# EAGLE design Prosthesis Motor Shield (EAGLE 6.5.0)
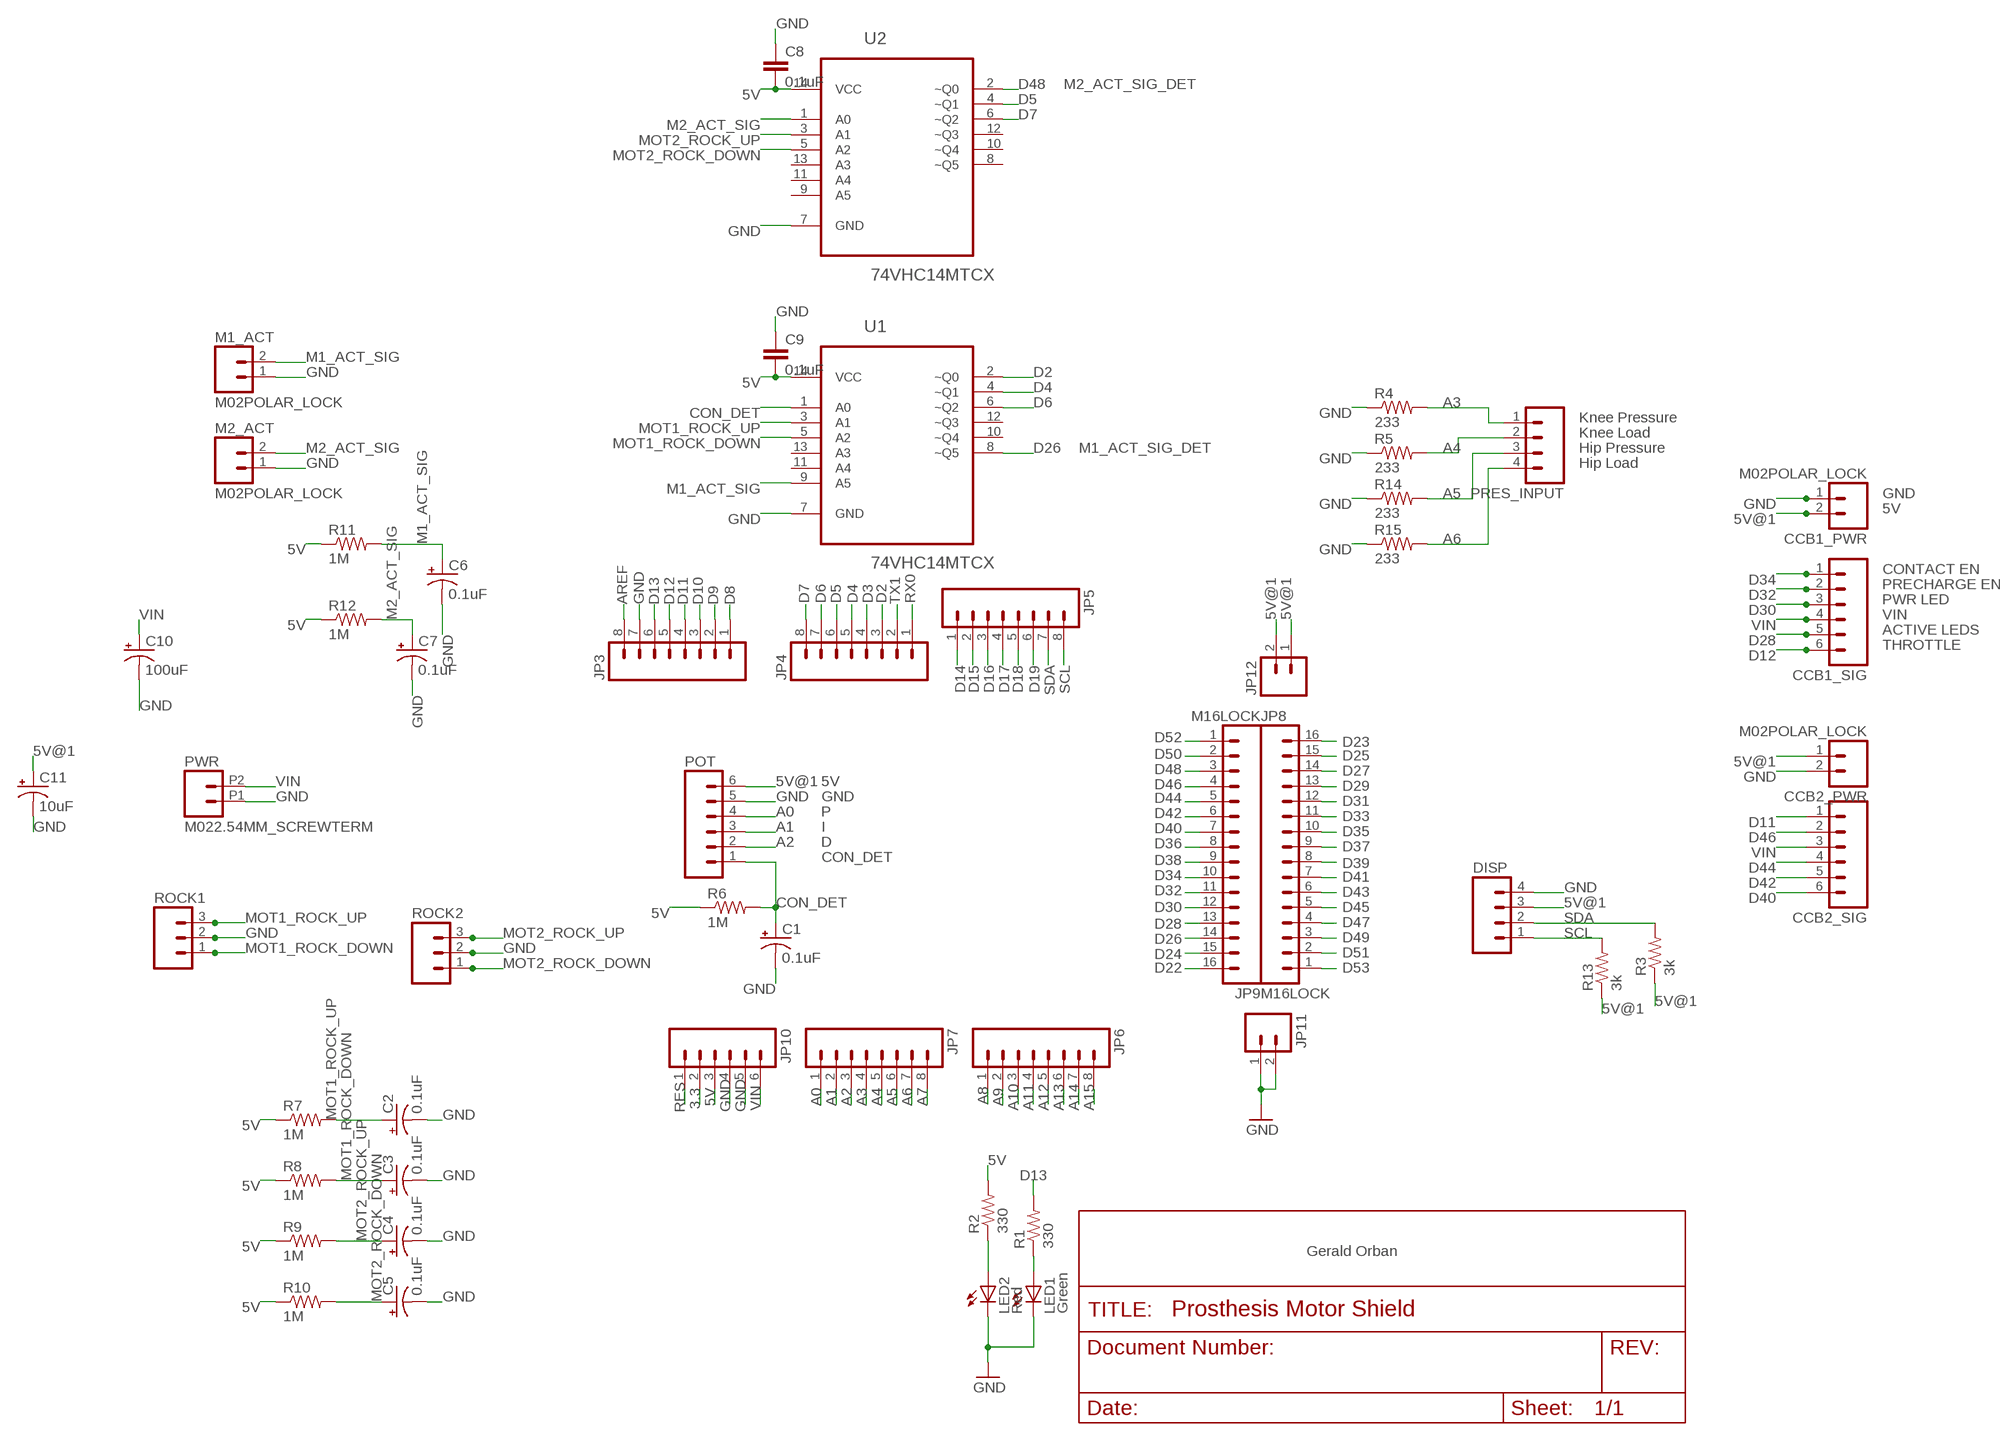
[diagram p0: schematic, sheet 1]

## Parts
C1  0.1uF  CAP_POL1206  [EIA3216]
C2  0.1uF  CAP_POL1206  [EIA3216]
C3  0.1uF  CAP_POL1206  [EIA3216]
C4  0.1uF  CAP_POL1206  [EIA3216]
C5  0.1uF  CAP_POL1206  [EIA3216]
C6  0.1uF  CAP_POL1206  [EIA3216]
C7  0.1uF  CAP_POL1206  [EIA3216]
C8  0.1uF  CAP0603-CAP  [0603-CAP]
C9  0.1uF  CAP0603-CAP  [0603-CAP]
C10  100uF  CAP_POLPTH1  [CPOL-RADIAL-100UF-25V]
C11  10uF  CAP_POLPTH2  [CPOL-RADIAL-10UF-25V]
CCB1_PWR  M02POLAR_LOCK  [MOLEX-1X2_LOCK]
CCB1_SIG  M06POLAR_LOCK  [MOLEX-1X6_LOCK]
CCB2_PWR  M02POLAR_LOCK  [MOLEX-1X2_LOCK]
CCB2_SIG  M06POLAR_LOCK  [MOLEX-1X6_LOCK]
DISP  M04POLAR_LOCK  [MOLEX-1X4_LOCK]
JP3  M08LOCK  [1X08_LOCK]
JP4  M08LOCK  [1X08_LOCK]
JP5  M08LOCK  [1X08_LOCK]
JP6  M08LOCK  [1X08_LOCK]
JP7  M08LOCK  [1X08_LOCK]
JP8  M16LOCK  [1X16_LOCK]
JP9  M16LOCK  [1X16_LOCK]
JP10  M06LOCK  [1X06_LOCK]
JP11  M02LOCK  [1X02_LOCK]
JP12  M02LOCK  [1X02_LOCK]
LED1  Green  LED1206  [LED-1206]
LED2  Red  LED1206  [LED-1206]
M1_ACT  M02POLAR_LOCK  [MOLEX-1X2_LOCK]
M2_ACT  M02POLAR_LOCK  [MOLEX-1X2_LOCK]
POT  M06POLAR_LOCK  [MOLEX-1X6_LOCK]
PRES_INPUT  M04POLAR_LOCK  [MOLEX-1X4_LOCK]
PWR  M022.54MM_SCREWTERM  [1X02_2.54_SCREWTERM]
R1  330  RESISTOR0805-RES  [0805]
R2  330  RESISTOR0805-RES  [0805]
R3  3k  RESISTOR0603  [0603-RES]
R4  233  RESISTORPTH-1/4W  [AXIAL-0.4]
R5  233  RESISTORPTH-1/4W  [AXIAL-0.4]
R6  1M  RESISTOR0603-RES  [0603-RES]
R7  1M  RESISTOR0603  [0603-RES]
R8  1M  RESISTOR0603  [0603-RES]
R9  1M  RESISTOR0603  [0603-RES]
R10  1M  RESISTOR0603  [0603-RES]
R11  1M  RESISTOR0603  [0603-RES]
R12  1M  RESISTOR0603  [0603-RES]
R13  3k  RESISTOR0603  [0603-RES]
R14  233  RESISTORPTH-1/4W  [AXIAL-0.4]
R15  233  RESISTORPTH-1/4W  [AXIAL-0.4]
ROCK1  M03POLAR_LOCK  [MOLEX-1X3_LOCK]
ROCK2  M03POLAR_LOCK  [MOLEX-1X3_LOCK]
U1  74VHC14MTCX  [SOP65P640X120-14N]
U2  74VHC14MTCX  [SOP65P640X120-14N]

## Nets
3.3: JP10.2
5V: C8.2 C9.2 JP10.3 R2.2 R6.1 R7.1 R8.1 R9.1 R10.1 R11.1 R12.1 U1.14(VCC) U2.14(VCC)
5V@1: C11.1(+) CCB1_PWR.2 CCB2_PWR.1 DISP.3 JP12.1 JP12.2 POT.6 R3.1 R13.1
A0: JP7.1 POT.4
A1: JP7.2 POT.3
A2: JP7.3 POT.2
A3: JP7.4 PRES_INPUT.1 R4.P$2
A4: JP7.5 PRES_INPUT.2 R5.P$2
A5: JP7.6 PRES_INPUT.3 R14.P$2
A6: JP7.7 PRES_INPUT.4 R15.P$2
A7: JP7.8
A8: JP6.1
A9: JP6.2
A10: JP6.3
A11: JP6.4
A12: JP6.5
A13: JP6.6
A14: JP6.7
A15: JP6.8
AREF: JP3.8
CON_DET: C1.A(+) POT.1 R6.2 U1.1(A0)
D2: JP4.3 U1.2(~Q0)
D3: JP4.4
D4: JP4.5 U1.4(~Q1)
D5: JP4.6 U2.4(~Q1)
D6: JP4.7 U1.6(~Q2)
D7: JP4.8 U2.6(~Q2)
D8: JP3.1
D9: JP3.2
D10: JP3.3
D11: CCB2_SIG.1 JP3.4
D12: CCB1_SIG.6 JP3.5
D13: JP3.6 R1.2
D14: JP5.1
D15: JP5.2
D16: JP5.3
D17: JP5.4
D18: JP5.5
D19: JP5.6
D22: JP9.16
D23: JP8.16
D24: JP9.15
D25: JP8.15
D26: JP9.14 U1.8(~Q5)
D27: JP8.14
D28: CCB1_SIG.5 JP9.13
D29: JP8.13
D30: CCB1_SIG.3 JP9.12
D31: JP8.12
D32: CCB1_SIG.2 JP9.11
D33: JP8.11
D34: CCB1_SIG.1 JP9.10
D35: JP8.10
D36: JP9.9
D37: JP8.9
D38: JP9.8
D39: JP8.8
D40: CCB2_SIG.6 JP9.7
D41: JP8.7
D42: CCB2_SIG.5 JP9.6
D43: JP8.6
D44: CCB2_SIG.4 JP9.5
D45: JP8.5
D46: CCB2_SIG.2 JP9.4
D47: JP8.4
D48: JP9.3 U2.2(~Q0)
D49: JP8.3
D50: JP9.2
D51: JP8.2
D52: JP9.1
D53: JP8.1
GND: C1.C(-) C2.C(-) C3.C(-) C4.C(-) C5.C(-) C6.C(-) C7.C(-) C8.1 C9.1 C10.2(-) C11.2(-) CCB1_PWR.1 CCB2_PWR.2 DISP.4 JP3.7 JP10.4 JP10.5 JP11.1 JP11.2 LED1.C LED2.C M1_ACT.1 M2_ACT.1 POT.5 PWR.P1 R4.P$1 R5.P$1 R14.P$1 R15.P$1 ROCK1.2 ROCK2.2 U1.7(GND) U2.7(GND)
M1_ACT_SIG: C6.A(+) M1_ACT.2 R11.2 U1.9(A5)
M2_ACT_SIG: C7.A(+) M2_ACT.2 R12.2 U2.1(A0)
MOT1_ROCK_DOWN: C3.A(+) R8.2 ROCK1.1 U1.5(A2)
MOT1_ROCK_UP: C2.A(+) R7.2 ROCK1.3 U1.3(A1)
MOT2_ROCK_DOWN: C5.A(+) R10.2 ROCK2.1 U2.5(A2)
MOT2_ROCK_UP: C4.A(+) R9.2 ROCK2.3 U2.3(A1)
N$126: LED2.A R2.1
N$127: LED1.A R1.1
RES: JP10.1
RX0: JP4.1
SCL: DISP.1 JP5.8 R13.2
SDA: DISP.2 JP5.7 R3.2
TX1: JP4.2
VIN: C10.1(+) CCB1_SIG.4 CCB2_SIG.3 JP10.6 PWR.P2
Unconnected: U1.10(~Q4) U1.11(A4) U1.12(~Q3) U1.13(A3) U2.8(~Q5) U2.9(A5) U2.10(~Q4) U2.11(A4) U2.12(~Q3) U2.13(A3)

## Notes on the sheet
- M2_ACT_SIG_DET
- Knee Pressure
- Knee Load
- M1_ACT_SIG_DET | Hip Pressure
- Hip Load
- GND
- 5V
- CONTACT EN
- PRECHARGE EN
- PWR LED
- VIN
- ACTIVE LEDS
- THROTTLE
- 5V
- GND
- P
- I
- D
- CON_DET
- Gerald Orban

## Library data of the parts
C1-C7 C10 C11 = SparkFun-Capacitors:CAP_POL: Capacitor Polarized These are standard SMD and PTH capacitors. Normally 10uF, 47uF, and 100uF in electrolytic and tantalum varieties. Always verify the external diameter of the through hole cap, it varies with capacity, voltage, and manufacturer. The EIA devices should be standard.
C8 C9 = SparkFun-Capacitors:CAP: Capacitor Standard 0603 ceramic capacitor, and 0.1" leaded capacitor.
CCB1_PWR CCB2_PWR M1_ACT M2_ACT PWR = SparkFun-Connectors:M02: Standard 2-pin 0.1" header. Use with - straight break away headers ( PRT-00116) - right angle break away headers (PRT-00553) - swiss pins (PRT-00743) - machine pins (PRT-00117) - female headers (PRT-00115) Molex polarized connector foot print use with: PRT-08233 with associated crimp pins and housings. 2.54_SCREWTERM for use with PRT-10571. 3.5mm Screw Terminal footprints for PRT-08084 5mm Screw Terminal footprints for use with PRT-08433
CCB1_SIG CCB2_SIG POT = SparkFun-Connectors:M06: Header 6 Standard 6-pin 0.1" header. Use with straight break away headers (SKU : PRT-00116), right angle break away headers (PRT-00553), swiss pins (PRT-00743), machine pins (PRT-00117), and female headers (PRT-00115). Molex polarized connector foot print use with SKU : PRT-08094 with associated ...
DISP PRES_INPUT = SparkFun-Connectors:M04: Header 4 Standard 4-pin 0.1" header. Use with straight break away headers (SKU : PRT-00116), right angle break away headers (PRT-00553), swiss pins (PRT-00743), machine pins (PRT-00117), and female headers (PRT-00115). Molex polarized connector foot print use with SKU : PRT-08231 with associated crimp pins and housings. 1MM SMD Version SKU: PRT-10208
JP3-JP7 = SparkFun:M08: Header 8 Standard 8-pin 0.1" header. Use with straight break away headers (SKU : PRT-00116), right angle break away headers (PRT-00553), swiss pins (PRT-00743), machine pins (PRT-00117), and female headers (PRT-00115).
JP8 JP9 = SparkFun:M16
JP10 = SparkFun:M06: Header 6 Standard 6-pin 0.1" header. Use with straight break away headers (SKU : PRT-00116), right angle break away headers (PRT-00553), swiss pins (PRT-00743), machine pins (PRT-00117), and female headers (PRT-00115). Molex polarized connector foot print use with SKU : PRT-08094 with associated ...
JP11 JP12 = SparkFun:M02: Header 2 Standard 2-pin 0.1" header. Use with straight break away headers (SKU : PRT-00116), right angle break away headers (PRT-00553), swiss pins (PRT-00743), machine pins (PRT-00117), and female headers (PRT-00115). Molex polarized connector foot print use with SKU : PRT-08233 with associated crimp pins and housings.
LED1 LED2 = SparkFun-LED:LED: LEDs Standard schematic elements and footprints for 5mm, 3mm, 1206, and 0603 sized LEDs. 5mm - Spark Fun Electronics SKU : COM-00529 (and others)
R1-R15 = SparkFun-Resistors:RESISTOR: Resistor Basic schematic elements and footprints for 0603, 1206, and PTH resistors.
ROCK1 ROCK2 = SparkFun-Connectors:M03: Header 3 Standard 3-pin 0.1" header. Use with straight break away headers (SKU : PRT-00116), right angle break away headers (PRT-00553), swiss pins (PRT-00743), machine pins (PRT-00117), and female headers (PRT-00115). Molex polarized connector foot print use with SKU : PRT-08232 with associated crimp pins and housings.
U1 U2 = Fairchild_By_element14_Batch_1:74VHC14MTCX: Hex Schmitt Inverter; MPN: 74VHC14MTCX; OC_FARNELL: 1249730; OC_NEWARK: 78K6373; PACKAGE: TSSOP-14; SUPPLIER: FAIRCHILD

## Board
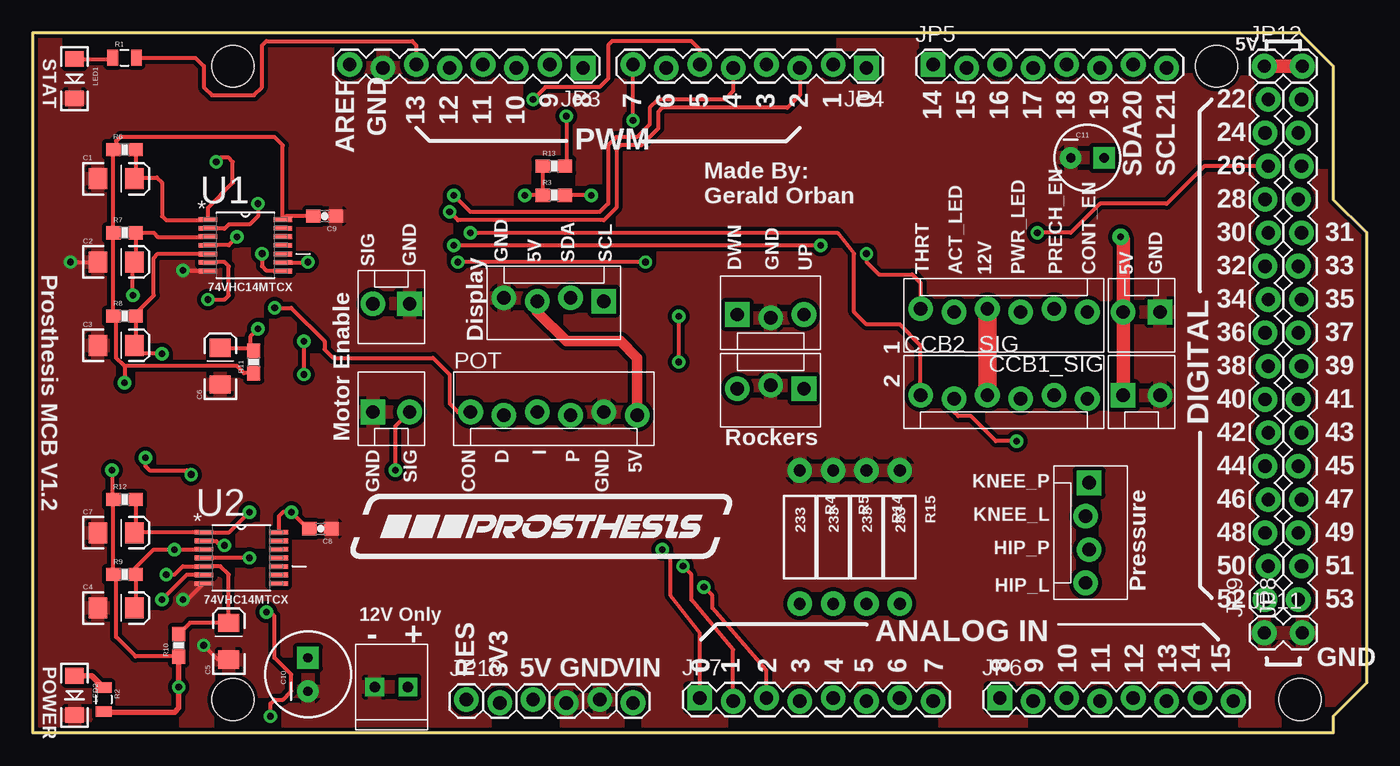
[diagram p1: board, top side]
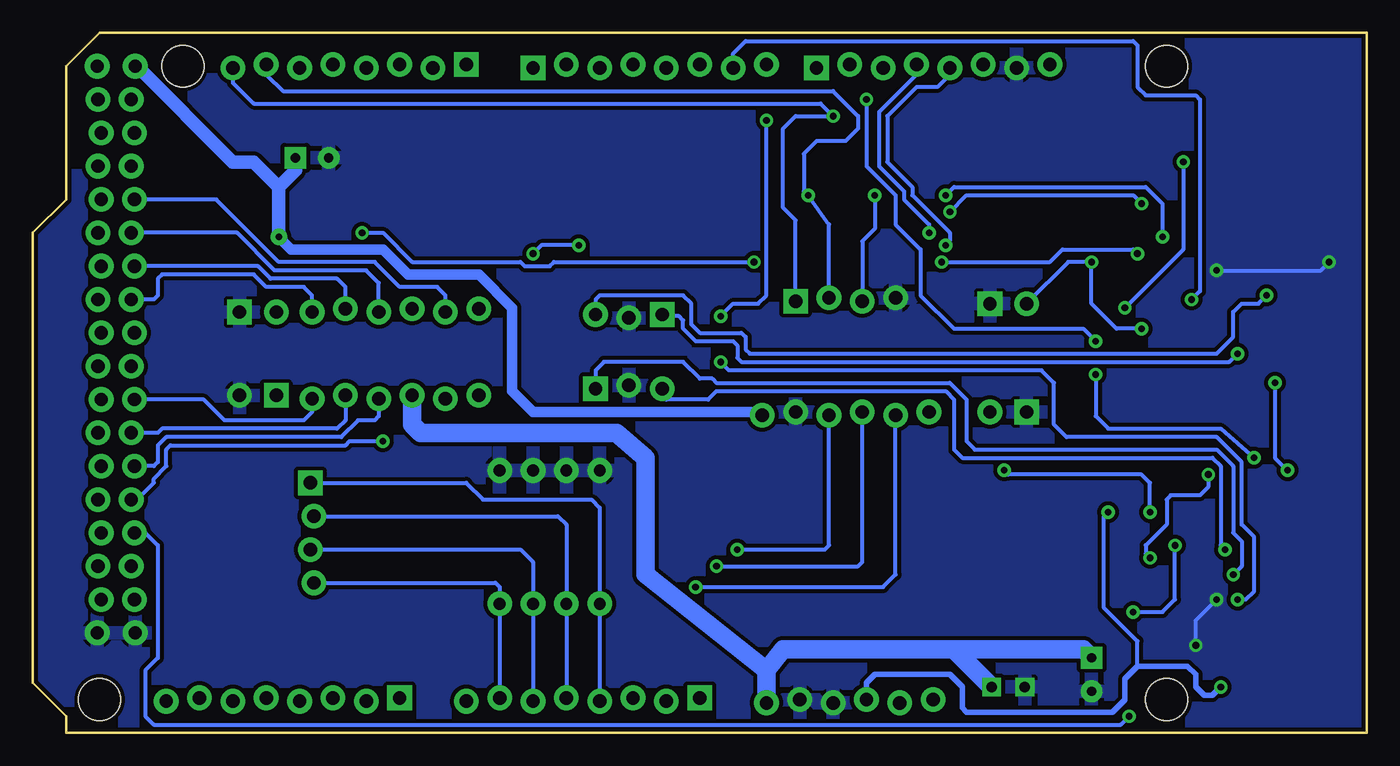
[diagram p2: board, bottom side, seen from below]

Size 101.6 x 53.34 mm. Coordinates in mm from the lower left corner, seen from the top.
Outline: 0,0 99.06,0 99.06,1.27 101.6,3.81 101.6,38.1 99.06,40.64 99.06,50.8 96.52,53.34 0,53.34 0,0
Copper layers (1*16): Top 0.035mm / dielectric 1.5mm / Bottom 0.035mm
Design rules "SparkFun *": minimum track width 8mil, minimum drill 20mil, track to track 10mil, track to pad 10mil, pad to pad 10mil, via to via 10mil, smd to smd 10mil, copper to edge 10mil, drill to drill 8mil, minimum pad ring 12mil, minimum via ring 10mil, stop-mask expansion 4mil, vias tented up to drill 25mil, thermal gap 10mil
Holes 3.2 mm at 15.24,50.8 15.24,2.54 90.17,50.8 96.52,2.54

### Footprints (pad centres in the part's own frame; a part is rotated, then mirrored left to right if it is on the bottom)
EIA3216 = smd 1.4 x 1.6: A 1.4,0; C -1.4,0
0603-CAP = smd 1.1 x 1: 1 -0.85,0; 2 0.85,0
CPOL-RADIAL-100UF-25V = drill 0.7 pad 1.651 square: 1 1.27,0 | drill 0.7 pad 1.651: 2 -1.27,0
CPOL-RADIAL-10UF-25V = drill 0.7 pad 1.651 square: 1 1.27,0 | drill 0.7 pad 1.651: 2 -1.27,0
MOLEX-1X2_LOCK = drill 1.016 pad 1.88 square: 1 -0.127,0 | drill 1.016 pad 1.88: 2 2.667,0
MOLEX-1X6_LOCK = drill 1.016 pad 1.88: 1 0,0; 2 2.54,-0.254; 3 5.08,0; 4 7.62,-0.254; 5 10.16,0; 6 12.7,-0.254
MOLEX-1X4_LOCK = drill 1.016 pad 1.88 square: 1 0,0.127 | drill 1.016 pad 1.88: 2 2.54,-0.127; 3 5.08,0.127; 4 7.62,-0.127
1X08_LOCK = drill 1.016 pad 1.88 square: 1 0,0.127 | drill 1.016 pad 1.88: 2 2.54,-0.127; 3 5.08,0.127; 4 7.62,-0.127; 5 10.16,0.127; 6 12.7,-0.127; 7 15.24,0.127; 8 17.78,-0.127
1X16_LOCK = drill 1.016 pad 1.88: 1 0,0.127; 2 2.54,-0.127; 3 5.08,0.127; 4 7.62,-0.127; 5 10.16,0.127; 6 12.7,-0.127; 7 15.24,0.127; 8 17.78,-0.127; 9 20.32,0.127; 10 22.86,-0.127; 11 25.4,0.127; 12 27.94,-0.127; 13 30.48,0.127; 14 33.02,-0.127; 15 35.56,0.127; 16 38.1,-0.127
1X06_LOCK = drill 1.016 pad 1.88: 1 0,0; 2 2.54,-0.254; 3 5.08,0; 4 7.62,-0.254; 5 10.16,0; 6 12.7,-0.254
1X02_LOCK = drill 1.016 pad 1.88: 1 -0.178,0; 2 2.718,0
LED-1206 = smd 1.2 x 1.4: A -1.5,0; C 1.5,0
1X02_2.54_SCREWTERM = drill 0.8 square: P1 2.54,0; P2 0,0
0805 = smd 0.8 x 1.2: 1 -0.9,0; 2 0.9,0
0603-RES = smd 1.1 x 1: 1 -0.85,0; 2 0.85,0
AXIAL-0.4 = drill 0.9 pad 1.88: P$1 -5.08,0; P$2 5.08,0
MOLEX-1X3_LOCK = drill 1.016 pad 1.88 square: 1 0,0.127 | drill 1.016 pad 1.88: 2 2.54,-0.127; 3 5.08,0.127
SOP65P640X120-14N = smd 1.422 x 0.356: 1 -2.845,1.956; 2 -2.845,1.295; 3 -2.845,0.66; 4 -2.845,0; 5 -2.845,-0.66; 6 -2.845,-1.295; 7 -2.845,-1.956; 8 2.845,-1.956; 9 2.845,-1.295; 10 2.845,-0.66; 11 2.845,0; 12 2.845,0.66; 13 2.845,1.295; 14 2.845,1.956

### Placement (x,y rotation side)
C1  6.35,42.23 0 top
C2  6.35,35.88 0 top
C3  6.35,29.53 0 top
C4  6.35,9.53 0 top
C5  14.92,6.99 90 top
C6  14.29,27.94 90 top
C7  6.35,15.24 0 top
C8  21.91,15.56 180 top
C9  22.23,39.37 180 top
C10  20.95,4.45 90 top
C11  80.33,43.81 0 top
CCB1_PWR  85.72,32.07 180 top
CCB1_SIG  80.33,32.07 180 top
CCB2_PWR  83.19,25.72 0 top
CCB2_SIG  67.63,25.72 0 top
DISP  43.5,33.02 180 top
JP3  41.91,50.8 180 top
JP4  63.5,50.8 180 top
JP5  68.58,50.8 0 top
JP6  73.66,2.54 0 top
JP7  50.8,2.54 0 top
JP8  96.52,10.16 90 top
JP9  93.98,10.16 90 top
JP10  33.02,2.54 0 top
JP11  93.98,7.62 0 top
JP12  93.98,50.8 0 top
LED1  3.17,49.85 270 top
LED2  3.17,2.86 270 top
M1_ACT  28.57,32.7 180 top
M2_ACT  26.04,24.45 0 top
POT  33.34,24.45 0 top
PRES_INPUT  80.33,19.05 270 top
PWR  28.57,3.49 180 top
R1  6.99,51.44 0 top
R2  5.4,2.54 270 top
R3  39.69,40.96 0 top
R4  58.42,14.92 270 top
R5  60.96,14.92 270 top
R6  6.99,44.45 0 top
R7  6.99,38.1 0 top
R8  6.99,31.75 0 top
R9  6.99,12.06 0 top
R10  11.11,6.67 90 top
R11  16.83,28.26 90 top
R12  6.99,17.78 0 top
R13  39.69,43.18 0 top
R14  63.5,14.92 270 top
R15  66.04,14.92 270 top
ROCK1  53.66,31.75 0 top
ROCK2  58.74,26.35 180 top
U1  16.19,37.15 0 top
U2  15.88,13.34 0 top
U$1  [PROS_LOGO]  22.54,11.75 0 top

### Tracks (layer width: path | path; a pad name or v marks a point on that pad's centre or on a via)
5V  (via drill 0.51, 0.51 pad 0.41)
  Top 0.305: R10.1 7.83,5.82 6.35,7.3 6.35,11.85 R9.1 R12.1 6.03,17.88 v6.03,20 | U2.14 18.73,15.3 18.73,16.51 19.05,16.83 v19.68,16.83 20.95,15.56 C8.2 | R11.1 16.09,27.41 15.56,27.94 6.99,27.94 | 6.99,27.94 6.35,28.57 6.35,31.54 R8.1 R7.1 R6.1 6.35,44.66 6.35,45.09 6.67,45.4 18.41,45.4 19.04,44.78 U1.14 19.3,39.37 C9.2 | 6.99,27.94 v6.99,26.67
  Top 0.406: R10.1 v11.11,3.49 11.11,1.91 10.79,1.59 5.5,1.59
  Top 0.61: R2.2 5.45,1.64 5.5,1.59
  Bottom 0.305: 17.46,5.08 17.46,6.99 20,9.53 20,16.51 v19.68,16.83 | v6.99,26.67 6.99,20.95 v6.03,20
  Bottom 0.406: JP10.3 38.1,3.81 37.47,4.45 31.75,4.45 30.8,3.49 30.8,1.91 30.48,1.59 19.37,1.59 18.41,2.54 18.41,4.13 17.46,5.08 13.65,5.08 13.02,4.45 13.02,3.49 12.38,2.86 11.75,2.86 v11.11,3.49
5V@1  (via drill 0.51, 0.51 pad 1.27)
  Top 0.305: R13.1 R3.1 v37.47,40.96
  Top 0.813: DISP.3 38.42,32.07 40.64,29.84 44.77,29.84 46.04,28.57 POT.6
  Top 1.016: JP12.1 JP12.2 | v82.87,37.78 83.06,37.59 CCB1_PWR.2 CCB2_PWR.1
  Bottom 0.305: v37.47,40.96 37.47,38.42 38.42,37.47 DISP.3
  Bottom 0.813: v82.87,37.78 81.92,36.83 74.93,36.83 73.03,34.92 67.63,34.92 65.09,32.38 65.09,26.04 63.5,24.45 46.93,24.45 POT.6
  Bottom 1.016: JP12.1 93.66,50.8 86.36,43.5 84.77,43.5 82.87,41.59 | 82.87,41.59 v82.87,37.78 | C11.1 81.6,42.86 82.87,41.59
A0  (via drill 0.51)
  Top 0.305: JP7.1 50.8,7.62 48.58,10.48 48.58,13.34 v47.94,13.97
  Bottom 0.305: v47.94,13.97 41.27,13.97 40.96,14.29 POT.4
A1  (via drill 0.51)
  Top 0.305: JP7.2 53.34,6.35 50.16,10.16 50.16,12.06 v49.53,12.7
  Bottom 0.305: v49.53,12.7 38.73,12.7 38.42,13.02 POT.3
A2  (via drill 0.51)
  Top 0.305: JP7.3 55.88,4.76 51.75,9.53 51.75,10.48 v51.12,11.11
  Bottom 0.305: v51.12,11.11 36.83,11.11 35.88,12.06 POT.2
A3
  Bottom 0.305: PRES_INPUT.1 68.58,19.05 67.31,17.78 59.05,17.78 58.42,17.14 R4.P$2 JP7.4
A4
  Bottom 0.305: PRES_INPUT.2 61.59,16.51 60.96,15.88 R5.P$2 JP7.5
A5
  Bottom 0.305: PRES_INPUT.3 64.45,13.97 63.5,13.02 R14.P$2 JP7.6
A6
  Bottom 0.305: PRES_INPUT.4 66.36,11.43 66.04,11.11 R15.P$2 JP7.7
CON_DET  (via drill 0.51)
  Top 0.305: R6.2 7.83,42.31 | 7.83,42.31 C1.A | 7.83,42.31 9.44,42.31 9.84,41.91 9.84,39.37 10.16,39.05 13.3,39.05 U1.1 13.35,40.02 15.24,41.91 15.24,43.5 14.92,43.81 14.29,43.81 v13.97,43.5 | v18.41,32.38 19.68,32.38 22.23,29.84 22.23,29.21 22.86,28.57 30.48,28.57 31.75,27.3 31.75,25.08 32.38,24.45 POT.1
  Bottom 0.305: v13.97,43.5 13.97,36.83 v18.41,32.38
D2  (via drill 0.51)
  Top 0.305: JP4.3 58.42,48.58 57.47,47.62 47.94,47.62 47.62,47.31 47.62,46.04 46.35,44.77 44.77,44.77 44.45,44.45 44.45,40.01 43.5,39.05 32.38,39.05 v31.75,39.69 | v17.14,40.32 17.14,39.37 16.51,38.73 14.92,38.73 14.61,38.42 13.37,38.42 U1.2
  Bottom 0.305: v31.75,39.69 30.48,40.96 17.78,40.96 v17.14,40.32
D4  (via drill 0.51)
  Top 0.305: JP4.5 53.34,48.9 52.7,48.26 47.62,48.26 46.99,47.62 46.99,46.35 46.04,45.4 44.45,45.4 43.81,44.77 43.81,40.32 43.18,39.69 33.34,39.69 v32.07,40.96 | v15.56,37.78 14.92,37.15 U1.4
  Bottom 0.305: v32.07,40.96 31.43,41.59 16.83,41.59 15.56,40.32 v15.56,37.78
D5  (via drill 0.51)
  Top 0.305: JP4.6 50.8,52.07 50.16,52.7 44.13,52.7 43.81,52.39 43.81,49.85 43.18,49.21 39.05,49.21 v38.1,48.26 | v20.64,29.84 v20.64,27.3 | v8.57,20.95 8.57,20.32 8.89,20 11.75,20 v12.06,19.68 | v16.51,13.34 U2.4
  Bottom 0.305: v38.1,48.26 38.1,43.18 35.88,40.96 35.88,38.73 33.97,36.83 33.97,33.34 31.43,30.8 21.59,30.8 v20.64,29.84 | v20.64,27.3 20.64,24.13 19.68,23.18 11.11,23.18 v8.57,20.95 | v12.06,19.68 12.06,18.73 12.7,18.1 14.92,18.1 15.24,17.78 15.24,15.88 16.83,14.29 16.83,13.65 v16.51,13.34
D6  (via drill 0.51)
  Top 0.305: v13.34,33.02 14.61,33.02 14.92,33.34 14.92,35.56 14.61,35.88 13.37,35.88 U1.6
  Bottom 0.305: JP4.7 48.26,51.75 47.31,52.7 17.78,52.7 17.46,52.39 17.46,49.21 16.83,48.58 13.02,48.58 12.7,48.26 12.7,33.66 v13.34,33.02
D7  (via drill 0.51)
  Top 0.305: U2.6 11.72,12.04 v9.84,10.16 | v49.21,28.26 v49.21,31.75 | v45.72,46.67 JP4.8
  Bottom 0.305: v9.84,10.16 9.21,10.16 8.57,10.79 8.57,14.92 9.53,15.88 9.53,20.64 11.43,22.54 22.86,22.54 23.81,23.5 23.81,26.67 24.77,27.62 48.58,27.62 v49.21,28.26 | v49.21,31.75 48.26,32.7 46.35,32.7 45.72,33.34 v45.72,46.67
D11  (via drill 0.51)
  Top 0.305: v33.34,38.1 61.28,38.1 62.55,36.51 62.55,32.07 63.5,31.11 66.04,31.11 67.63,29.53 CCB2_SIG.1
  Bottom 0.305: JP3.4 34.29,50.16 37.15,47.31 37.15,43.18 35.24,41.27 35.24,40.64 33.34,38.73 v33.34,38.1
D12  (via drill 0.51)
  Top 0.305: v32.07,37.15 v60.01,37.15 | v63.5,36.51 63.5,35.88 64.45,34.92 66.99,34.92 67.63,34.29 CCB1_SIG.6
  Bottom 0.305: JP3.5 31.75,50.16 32.7,49.21 34.29,49.21 36.51,46.99 36.51,43.5 34.61,41.59 34.61,40.96 31.75,38.1 31.75,37.47 v32.07,37.15 | v60.01,37.15 62.87,37.15 v63.5,36.51
D13
  Top 0.305: JP3.6 29.21,52.39 28.89,52.7 17.78,52.7 17.46,52.39 17.46,49.21 16.83,48.58 13.65,48.58 13.02,49.21 13.02,50.8 12.7,51.12 12.38,51.44 R1.2
D26  (via drill 0.51)
  Top 0.305: JP9.14 89.22,43.18 86.36,40.32 81.28,40.32 79.06,38.1 v76.52,38.1 | v46.67,35.88 v32.38,35.88 | v17.46,36.51 17.46,35.56 17.78,35.24 18.99,35.24 U1.8
  Bottom 0.305: v76.52,38.1 74.93,38.1 72.71,35.88 64.45,35.88 64.14,35.56 62.23,35.56 61.91,35.88 v46.67,35.88 | v32.38,35.88 24.13,35.88 23.18,36.83 17.78,36.83 v17.46,36.51
D28
  Bottom 0.305: CCB1_SIG.5 70.17,33.34 70.8,33.97 73.66,33.97 75.56,35.88 82.87,35.88 87.63,40.64 JP9.13
D30
  Bottom 0.305: CCB1_SIG.3 75.25,34.29 76.2,35.24 83.19,35.24 86.04,38.1 JP9.12
D32
  Bottom 0.305: CCB1_SIG.2 77.79,33.97 78.42,34.61 83.5,34.61 84.45,35.56 JP9.11
D34
  Bottom 0.305: CCB1_SIG.1 80.33,33.34 80.96,33.97 83.82,33.97 84.77,34.92 91.76,34.92 92.08,34.61 92.08,33.34 92.39,33.02 JP9.10
D40
  Bottom 0.305: CCB2_SIG.6 80.33,24.45 80.96,23.81 87,23.81 88.58,25.4 JP9.7
D42
  Bottom 0.305: CCB2_SIG.5 77.79,23.81 78.42,23.18 91.76,23.18 92.08,22.86 JP9.6
D44
  Bottom 0.305: CCB2_SIG.4 75.25,24.13 75.56,23.81 76.83,23.81 78.11,22.54 91.44,22.54 92.08,21.91 92.08,20.64 92.39,20.32 JP9.5
D46  (via drill 0.51)
  Top 0.305: v74.93,22.23 73.34,22.23 71.44,24.13 70.48,24.13 70.17,24.45 CCB2_SIG.2
  Bottom 0.305: JP9.4 93.66,17.78 92.39,19.05 92.39,19.37 91.44,20.32 91.44,21.59 91.12,21.91 77.79,21.91 77.47,22.23 v74.93,22.23
D48  (via drill 0.51)
  Top 0.305: v18.1,1.27 18.1,2.22 18.41,2.54 19.05,2.54 19.68,3.17 19.68,4.45 18.41,5.71 18.41,8.89 18.1,9.21 v17.78,9.21 | v14.61,14.29 14.29,14.29 13.97,14.61 13.06,14.61 U2.2
  Bottom 0.305: JP9.3 93.03,15.24 92.08,14.29 92.08,5.71 93.03,4.76 93.03,1.27 92.39,0.64 18.73,0.64 v18.1,1.27 | v17.78,9.21 15.56,9.21 14.61,10.16 v14.61,14.29
GND  (via drill 0.51)
  Top 0.305: C5.C 14.1,5.58 v13.02,6.67 | v11.43,10.16 11.81,10.16 U2.7 | U1.7 11.48,35.19 v11.43,35.24 | v2.86,35.88 C2.C
  Bottom 0.305: v13.02,6.67 13.02,8.57 v11.43,10.16 | v11.43,35.24 3.49,35.24 v2.86,35.88
  pour Bottom (isolate 0.305): 0,0 99.06,0 99.06,1.27 101.6,3.81 101.6,38.1 99.06,40.64 99.06,50.8 96.52,53.34 0.32,53.34 0,2.54
  pour Top (isolate 0.305): 0,0 99.06,0 99.06,1.27 101.6,3.81 101.6,38.1 99.06,40.64 99.06,50.8 96.52,53.34 0.32,53.34
M1_ACT_SIG  (via drill 0.51)
  Top 0.305: C6.A 16.59,29.34 | 16.59,29.34 R11.2 | U1.9 20.93,35.85 v20.95,35.88 | 16.59,29.34 16.59,30.25 v17.14,30.8
  Bottom 0.305: M1_ACT.2 22.73,35.88 v20.95,35.88 20.95,32.7 19.05,30.8 v17.14,30.8
M2_ACT_SIG  (via drill 0.51)
  Top 0.305: R12.2 7.83,15.32 | 7.83,15.32 C7.A | 7.83,15.32 13,15.32 U2.1 14.97,15.29 v16.51,16.83 | v27.62,20 27.62,23.37 M2_ACT.2
  Bottom 0.305: v16.51,16.83 16.51,19.05 17.14,19.68 27.3,19.68 v27.62,20
MOT1_ROCK_DOWN  (via drill 0.51)
  Top 0.305: U1.5 13.32,36.51 9.53,36.51 9.21,36.2 9.21,33.34 7.83,31.96 R8.2 7.83,29.61 C3.A 8.38,28.89 v9.84,28.89
  Bottom 0.305: v9.84,28.89 10.48,28.26 47.62,28.26 47.94,28.57 47.94,29.53 48.26,29.84 51.12,29.84 52.07,30.8 52.07,31.43 52.39,31.75 53.53,31.75 ROCK1.1
MOT1_ROCK_UP  (via drill 0.51)
  Top 0.305: U1.3 13.32,37.78 9.53,37.78 9.21,38.1 R7.2 7.83,35.96 C2.A 7.62,35.75 v7.62,33.34
  Bottom 0.305: v7.62,33.34 8.26,32.7 9.53,32.7 10.16,32.07 10.16,30.16 11.43,28.89 46.99,28.89 47.31,29.21 47.31,30.16 47.62,30.48 50.8,30.48 51.44,31.11 51.44,32.7 52.07,33.34 58.42,33.34 58.74,33.02 ROCK1.3
MOT2_ROCK_DOWN  (via drill 0.51)
  Top 0.305: R10.2 11.98,8.38 C5.A 14.92,12.06 14.29,12.7 13.06,12.7 U2.5 13.01,12.7 11.43,12.7 10.79,12.06 v10.16,12.06
  Bottom 0.305: v10.16,12.06 9.53,12.7 9.53,14.61 10.16,15.24 10.16,20.32 11.43,21.59 29.84,21.59 30.48,22.23 30.48,25.4 31.75,26.67 49.53,26.67 49.85,26.99 50.8,26.99 52.07,28.26 58.1,28.26 58.74,27.62 ROCK2.1
MOT2_ROCK_UP  (via drill 0.51)
  Top 0.305: C4.A 7.83,9.61 R9.2 7.83,12.6 9.21,13.97 v10.79,13.97 13.01,13.97 U2.3
  Bottom 0.305: v10.79,13.97 11.11,14.29 11.11,20.32 11.75,20.95 30.8,20.95 31.43,21.59 31.43,25.4 32.07,26.04 49.53,26.04 50.16,25.4 53.34,25.4 53.66,25.72 ROCK2.3
N$126
  Top 0.406: LED2.A 4.48,4.36 R2.1
N$127
  Top 0.305: LED1.A 6,51.35 R1.1
SCL  (via drill 0.51)
  Top 0.305: v40.64,46.99 40.64,43.28 R13.2
  Bottom 0.305: JP5.8 86.36,49.53 84.77,47.94 41.59,47.94 v40.64,46.99 43.5,46.99 44.45,46.04 44.45,40.01 43.5,39.05 DISP.1
SDA  (via drill 0.51)
  Top 0.305: v42.55,40.96 R3.2
  Bottom 0.305: JP5.7 83.82,50.16 82.55,48.9 40.64,48.9 38.73,46.99 38.73,46.04 39.69,45.09 41.91,45.09 42.86,44.13 42.86,41.27 v42.55,40.96 40.96,38.73 DISP.2
VIN
  Top 1.422: CCB1_SIG.4 CCB2_SIG.3
  Bottom 1.422: 45.72,4.76 54.93,12.06 54.93,20.95 57.15,22.86 72.07,22.86 72.71,23.5 CCB2_SIG.3 | 45.72,4.76 JP10.6 | PWR.P2 31.43,6.35 | 31.43,6.35 44.45,6.35 45.72,4.76 | 31.43,6.35 21.59,6.35 C10.1

### Text on the board
tPlace: 5V | STAT | 9 | 8 | 7 | 6 | 5 | 4 | 3 | 2 | 1 | 0 | 22 | 14 | 15 | 16 | 17 | 18 | 19 | 20 | 21 | 13 | 12 | 11 | 10 | GND | 24 | AREF | PWM | 26 | SDA | SCL | Made By: / Gerald Orban | 28 | 30 | 31 | SIG | GND | GND | 5V | SDA | SCL | Prosthesis MCB V1.2 | DWN | GND | UP | THRT | ACT_LED | 12V | PWR_LED | PRECH_EN | CONT_EN | 5V | GND | 32 | 33 | 74VHC14MTCX | 34 | 35 | Display | 1 | 36 | 37 | 2 | 38 | 39 | 40 | 41 | DIGITAL | Motor Enable | GND | SIG | CON | D | I | P | GND | 5V | Rockers | 42 | 43 | KNEE_P | 44 | 45 | KNEE_L | 46 | 47 | HIP_P | 48 | 49 | HIP_L | 50 | 51 | Pressure | 74VHC14MTCX | 12V Only | 52 | 53 | - | + | ANALOG IN | POWER | 0 | 1 | 2 | 3 | 4 | 5 | 6 | 7 | 8 | 9 | 10 | 11 | 12 | 13 | 14 | 15 | GND | RES | 3V3 | 5V | GND | VIN